# EAGLE design cartucho_throwhole (EAGLE 6.5.0)
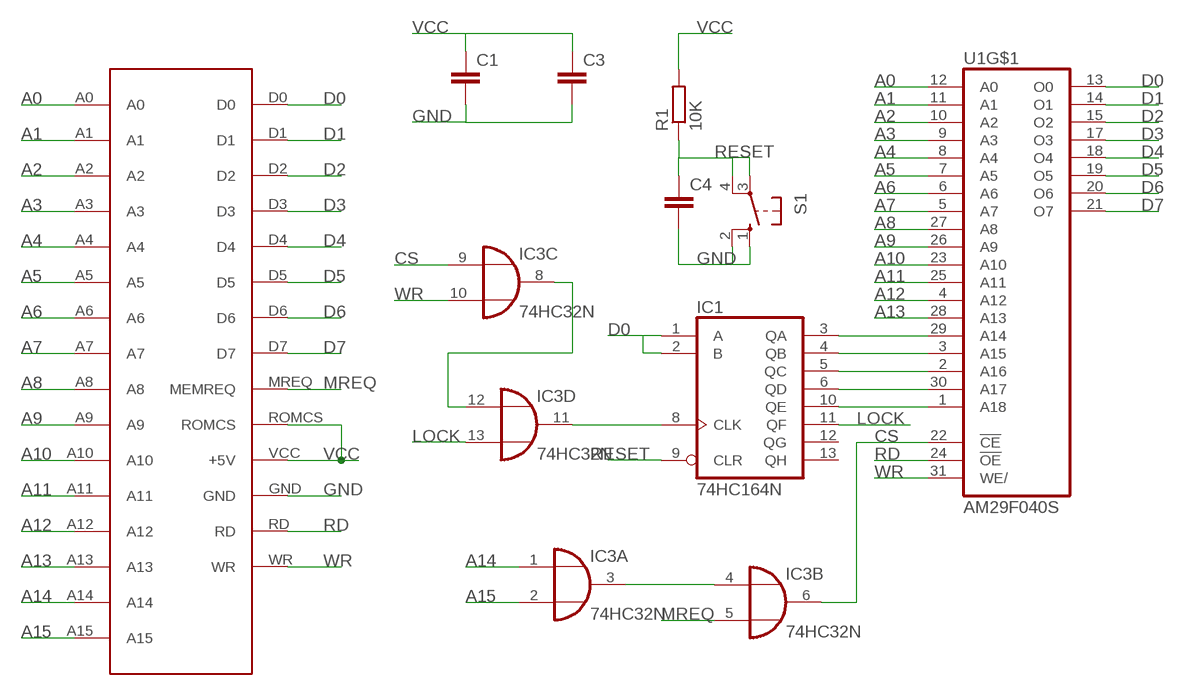
[diagram p0: schematic, sheet 1]

## Parts
C1  C-EU050-025X075  [C050-025X075]
C3  C-EU050-025X075  [C050-025X075]
C4  C-EU050-025X075  [C050-025X075]
IC1  74HC164N  [DIL14]
IC3  74HC32N  [DIL14]
R1  10K  R-EU_0204/7  [0204/7]
S1  10-XX  [B3F-10XX]
U1  AM29F040S  [PLCC-SR32]
U$1  IF2BUS  [BUS_CARTUCHO_IF2]

## Nets
A0: U1.12(A0) U$1.A0
A1: U1.11(A1) U$1.A1
A2: U1.10(A2) U$1.A2
A3: U1.9(A3) U$1.A3
A4: U1.8(A4) U$1.A4
A5: U1.7(A5) U$1.A5
A6: U1.6(A6) U$1.A6
A7: U1.5(A7) U$1.A7
A8: U1.27(A8) U$1.A8
A9: U1.26(A9) U$1.A9
A10: U1.23(A10) U$1.A10
A11: U1.25(A11) U$1.A11
A12: U1.4(A12) U$1.A12
A13: U1.28(A13) U$1.A13
A14: IC3.1(A:I0) U$1.A14
A15: IC3.2(A:I1) U$1.A15
CS: IC3.6(B:O) IC3.9(C:I0) U1.22(!CE)
D0: IC1.1(A) IC1.2(B) U1.13(O0) U$1.D0
D1: U1.14(O1) U$1.D1
D2: U1.15(O2) U$1.D2
D3: U1.17(O3) U$1.D3
D4: U1.18(O4) U$1.D4
D5: U1.19(O5) U$1.D5
D6: U1.20(O6) U$1.D6
D7: U1.21(O7) U$1.D7
GND: C1.2 C3.2 C4.2 S1.1(S) S1.2(S1) U$1.GND
LOCK: IC1.11(QF) IC3.13(D:I1)
MREQ: IC3.5(B:I1) U$1.MREQ(MEMREQ)
N$2: IC1.10(QE) U1.1(A18)
N$3: IC1.6(QD) U1.30(A17)
N$4: IC1.5(QC) U1.2(A16)
N$5: IC1.4(QB) U1.3(A15)
N$6: IC1.3(QA) U1.29(A14)
N$7: IC3.3(A:O) IC3.4(B:I0)
N$10: IC1.8(CLK) IC3.11(D:O)
N$11: IC3.8(C:O) IC3.12(D:I0)
RD: U1.24(!OE) U$1.RD
RESET: C4.1 IC1.9(CLR) R1.1 S1.3(P) S1.4(P1)
VCC: C1.1 C3.1 R1.2 U$1.ROMCS U$1.VCC(+5V)
WR: IC3.10(C:I1) U1.31(WE/) U$1.WR
Unconnected: IC1.12(QG) IC1.13(QH)

## Power pins joined to a net without a drawn wire
GND: IC1.7(GND) IC3.7(P:GND) U1.16(GND)
VCC: IC1.14(VCC) IC3.14(P:VCC) U1.32(VCC)

## Library data of the parts
C1 C3 C4 = rcl:C-EU: CAPACITOR, European symbol
IC1 = 74xx-us:74*164: 8-bit parallel out SHIFT REGISTER
IC3 = 74xx-eu:74*32: Quad 2-input OR gate
R1 = rcl:R-EU_: RESISTOR, European symbol
S1 = switch-omron:10-XX: OMRON SWITCH; MPN: B3F-1000; OC_FARNELL: 176432; OC_NEWARK: 36M3542
U1 = am29-memory:AM29F040S
U$1 = SPECTRUM:IF2BUS

## Board
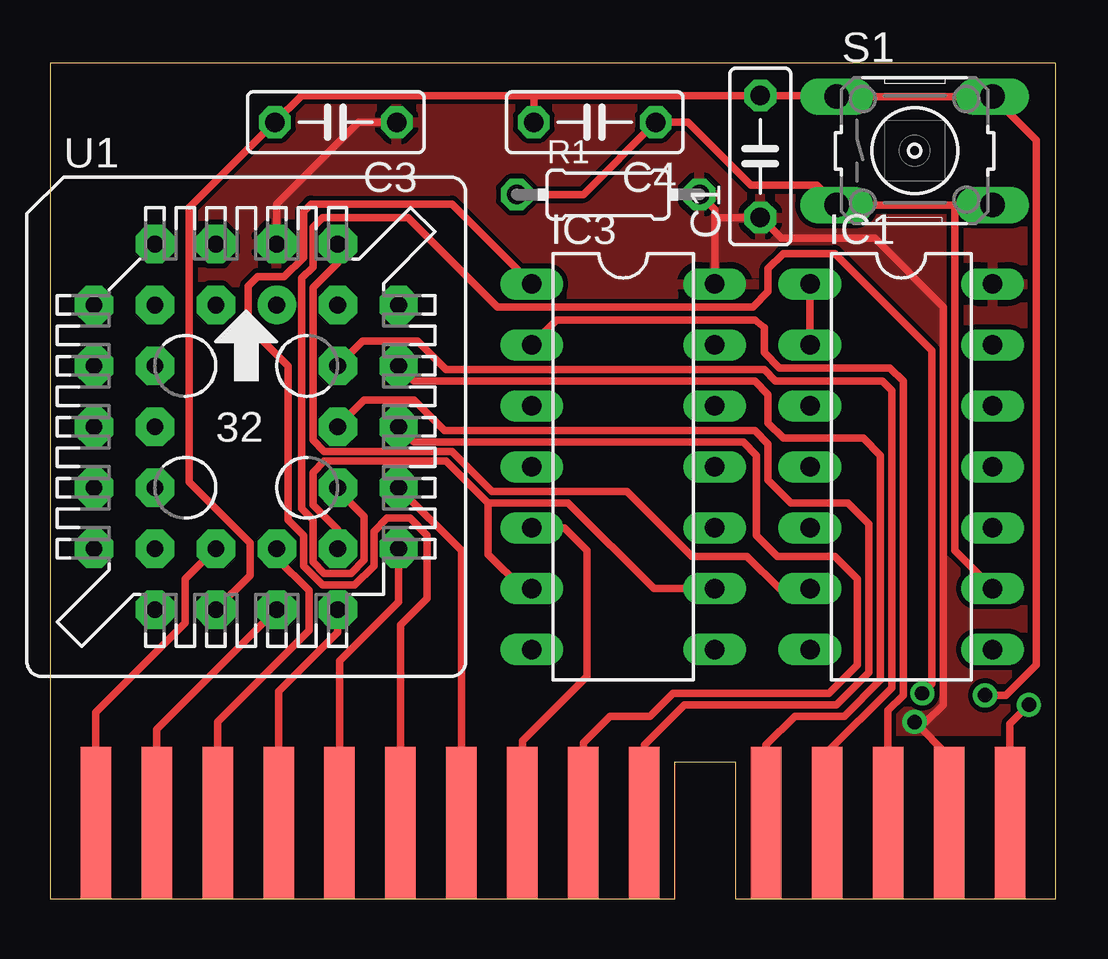
[diagram p1: board, top side]
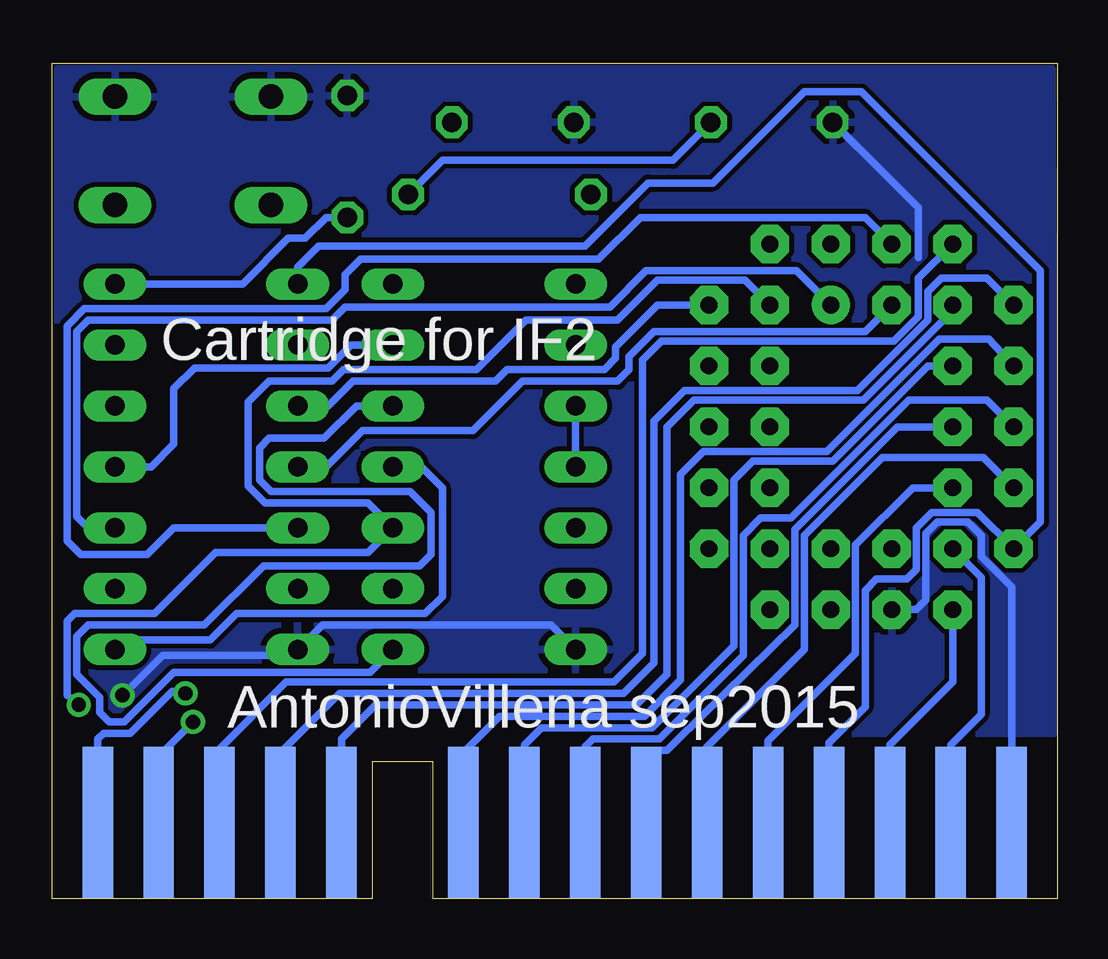
[diagram p2: board, bottom side, seen from below]

No outline drawn. Coordinates in mm, seen from the top.
Copper layers (1*16): Top 0.035mm / dielectric 1.5mm / Bottom 0.035mm
Design rules "default": minimum track width 10mil, minimum drill 24mil, track to track 8mil, track to pad 8mil, pad to pad 8mil, via to via 8mil, smd to smd 8mil, copper to edge 40mil, drill to drill 8mil, minimum pad ring 10mil, minimum via ring 8mil, stop-mask expansion 4mil, vias tented up to drill 0mil, thermal gap 10mil
Milling: 8 lines

### Footprints (pad centres in the part's own frame; a part is rotated, then mirrored left to right if it is on the bottom)
C050-025X075 = drill 0.813 octagon: 1 -2.54,0; 2 2.54,0
DIL14 = drill 0.813 long: 1 -7.62,-3.81; 2 -5.08,-3.81; 3 -2.54,-3.81; 4 0,-3.81; 5 2.54,-3.81; 6 5.08,-3.81; 7 7.62,-3.81; 8 7.62,3.81; 9 5.08,3.81; 10 2.54,3.81; 11 0,3.81; 12 -2.54,3.81; 13 -5.08,3.81; 14 -7.62,3.81
0204/7 = drill 0.813 octagon: 1 -3.81,0; 2 3.81,0
B3F-10XX = drill 1.016 long: 1 -3.251,2.261; 2 3.251,2.261; 3 -3.251,-2.261; 4 3.251,-2.261
PLCC-SR32 = drill 0.7 pad 1.6: 1 1.27,5.08 | drill 0.7 pad 1.6 octagon: 2 -1.27,7.62; 3 -1.27,5.08; 4 -3.81,7.62; 5 -6.35,5.08; 6 -3.81,5.08; 7 -6.35,2.54; 8 -3.81,2.54; 9 -6.35,0; 10 -3.81,0; 11 -6.35,-2.54; 12 -3.81,-2.54; 13 -6.35,-5.08; 14 -3.81,-7.62; 15 -3.81,-5.08; 16 -1.27,-7.62; 17 -1.27,-5.08; 18 1.27,-7.62; 19 1.27,-5.08; 20 3.81,-7.62; 21 6.35,-5.08; 22 3.81,-5.08; 23 6.35,-2.54; 24 3.81,-2.54; 25 6.35,0; 26 3.81,0; 27 6.35,2.54; 28 3.81,2.54; 29 6.35,5.08; 30 3.81,7.62; 31 3.81,5.08; 32 1.27,7.62
BUS_CARTUCHO_IF2 = smd 1.27 x 6.35 bottom: A0 -27.305,3.175; A1 -24.765,3.175; A2 -22.225,3.175; A3 -19.685,3.175; A4 -17.145,3.175; A5 -14.605,3.175; A6 -9.525,3.175; A7 -6.985,3.175; A12 -4.445,3.175; D0 -29.845,3.175; D1 -32.385,3.175; D2 -34.925,3.175; GND -37.465,3.175; RD 0.635,3.175; ROMCS -1.905,3.175 | smd 1.27 x 6.35: A8 -9.525,3.175; A9 -14.605,3.175; A10 -22.225,3.175; A11 -17.145,3.175; A13 -6.985,3.175; A14 -24.765,3.175; A15 -4.445,3.175; D3 -37.465,3.175; D4 -34.925,3.175; D5 -32.385,3.175; D6 -29.845,3.175; D7 -27.305,3.175; MREQ -19.685,3.175; VCC -1.905,3.175; WR 0.635,3.175

### Placement (x,y rotation side)
C1  100nF  [C050-025X075]  29.61,30.96 90 top
C3  100nF  [C050-025X075]  11.91,32.38 180 top
C4  4.7uF  [C050-025X075]  22.7,32.38 180 top
IC1  35.48,18.02 270 top
IC3  23.89,18.02 270 top
R1  23.26,29.37 0 top
S1  RESET  [B3F-10XX]  36.04,31.19 0 top
U1  8.18,19.68 0 top
U$1  39.37,0 0 top

### Tracks (layer width: path | path; a pad name or v marks a point on that pad's centre or on a via)
A0
  Bottom 0.305: U$1.A0 12.06,6.59 8.41,10.24 8.41,14.76 6.03,17.14 U1.12
A1
  Bottom 0.305: U$1.A1 14.61,6.35 10.56,10.4 10.56,15.16 7.3,18.41 3.1,18.41 U1.11
A2
  Bottom 0.305: U1.10 6.67,19.68 10.95,15.4 10.95,11.43 15.88,6.59 16.27,6.19 17.14,6.19 U$1.A2
A3
  Bottom 0.305: U$1.A3 19.68,6.35 19.37,6.67 16.59,6.67 13.1,10.16 13.1,15.16 12.38,15.88 11.11,15.88 6.19,20.8 2.94,20.8 U1.9
A4
  Bottom 0.305: U$1.A4 22.23,6.43 21.51,7.14 16.91,7.14 13.49,10.56 13.49,17.46 12.7,18.26 9.37,18.26 5.4,22.23 U1.8
A5
  Bottom 0.305: U1.7 2.86,23.34 4.92,23.34 9.6,18.65 14.76,18.65 15.72,17.7 15.72,9.13 17.22,7.62 23.26,7.62 24.77,6.11 U$1.A5
A6
  Bottom 0.305: U$1.A6 29.84,6.67 28.42,8.1 17.54,8.1 16.27,9.37 16.27,19.68 15.16,20.8 8.1,20.8 4.37,24.53 U1.6
A7
  Bottom 0.305: U$1.A7 32.38,6.11 29.92,8.57 18.1,8.57 16.83,9.84 16.83,19.92 15.56,21.19 8.33,21.19 5.4,24.13 5.4,25.32 4.84,25.88 2.94,25.88 U1.5
A8
  Top 0.305: U$1.A8 29.84,6.43 31.04,7.62 33.1,7.62 34.61,9.13 34.61,18.49 33.89,19.21 30.56,19.21 29.92,19.84 29.92,21.03 29.37,21.59 15.16,21.59 U1.27
A9
  Top 0.305: U$1.A9 24.77,6.43 26.43,8.1 32.78,8.1 34.13,9.45 34.13,15.64 33.26,16.51 30.88,16.51 29.92,17.46 29.92,18.97 29.37,19.53 16.43,19.53 15.16,20.8 13.1,20.8 U1.26
A10
  Top 0.305: U$1.A10 17.14,14.53 U1.23
A11
  Top 0.305: U$1.A11 22.23,6.51 23.34,7.62 25,7.62 25.96,8.57 32.46,8.57 33.66,9.76 33.66,13.34 32.7,14.29 30.32,14.29 29.45,15.16 29.45,18.49 28.89,19.05 15.16,19.05 U1.25
A12
  Bottom 0.305: U1.4 5.79,25.88 5.79,24.29 6.83,23.26 16.51,23.26 17.3,22.46 17.3,10.24 18.49,9.05 32.15,9.05 34.92,6.27 U$1.A12
A13
  Top 0.305: U$1.A13 32.38,6.11 35.08,8.81 35.08,21.19 34.69,21.59 30.24,21.59 29.77,22.07 16.51,22.07 15.32,23.26 13.02,23.26 U1.28
A14
  Top 0.305: U$1.A14 14.61,11.43 15.72,12.54 15.72,15.16 15,15.88 14.05,15.88 13.49,15.32 13.49,13.89 12.7,13.1 11.35,13.1 10.56,13.89 10.56,15.16 9.92,15.8 9.92,22.23 8.26,23.89 8.26,25.56 8.65,25.96 9.76,25.96 10.56,26.75 10.56,28.65 10.87,28.97 16.75,28.97 IC3.1
A15
  Top 0.305: U$1.A15 34.92,7.86 35.56,8.49 35.56,21.59 35,22.15 30.4,22.15 29.77,22.78 29.77,23.81 29.37,24.13 21.11,24.13 IC3.2
CS
  Top 0.305: 18.26,16.51 16.51,18.26 11.43,18.26 10.95,17.78 10.95,16.43 11.99,15.4 U1.22 | 18.26,16.51 21.59,16.51 25.16,12.94 IC3.9 | IC3.6 19.68,12.94 18.26,14.37 18.26,16.51
D0
  Top 0.305: IC1.1 IC1.2
  Bottom 0.305: U$1.D0 9.53,6.51 8.02,8.02 8.02,12.86 7.54,13.34 6.27,13.34 5.87,13.73 5.87,15.48 5.24,16.11 3.33,16.11 U1.13 0.71,15.72 0.71,26.19 8.18,33.66 10.56,33.66 14.37,29.84 17.07,29.84 19.68,27.23 30.8,27.23 31.67,26.35 IC1.1
D1
  Bottom 0.305: U1.14 4.37,9.05 6.99,6.43 U$1.D1
D2
  Bottom 0.305: U1.15 3.17,13.41 3.17,7.7 4.45,6.43 U$1.D2
D3
  Top 0.305: U$1.D3 1.91,7.78 5.64,11.51 5.64,13.34 U1.17
D4
  Top 0.305: U$1.D4 4.45,7.06 U1.18
D5
  Top 0.305: U1.19 9.45,14.21 10.79,12.86 10.79,11.19 6.99,7.38 U$1.D5
D6
  Top 0.305: U$1.D6 9.53,8.65 11.99,11.11 U1.20
D7
  Top 0.305: U$1.D7 12.06,9.92 14.53,12.38 U1.21
GND  (via drill 0.6)
  Top 0.305: U1.16 8.33,13.49 8.33,14.84 5.79,17.38 5.79,28.81 C3.2 10.48,33.5 20.16,33.5 | 20.16,33.5 C1.2 33.3,33.5 S1.1 S1.2 41.12,31.63 41.12,9.76 39.85,8.49 v38.97,8.49 | C4.2 20.16,33.5
  Bottom 0.305: U$1.GND 1.91,13.02 3.17,14.29 3.17,15.16 3.73,15.72 5,15.72 5.48,15.24 5.48,12.46 5.87,12.06 U1.16 | 8.33,31.35 C3.2 5.79,28.81 5.79,26.75 | IC3.7 21.11,11.43 30.64,11.43 IC1.7 32.31,10.4 32.54,10.16 37.31,10.16 v38.97,8.49
  pour Bottom: 0.24,34.61 41.67,34.61 41.67,6.91 0.16,6.91 0.16,23.65
LOCK
  Bottom 0.305: IC3.13 29.45,23.1 30.4,22.15 35.96,22.15 36.83,21.27 36.83,18.97 37.78,18.02 IC1.11
MREQ
  Top 0.305: U$1.MREQ 19.68,6.59 22.38,9.29 22.38,14.53 21.43,15.48 IC3.5
N$2
  Bottom 0.305: U1.1 10.87,26.19 17.14,26.19 18.65,24.69 29.69,24.69 30.24,24.13 40.4,24.13 40.88,23.65 40.88,15.95 40.4,15.48 IC1.10
N$3
  Top 0.305: IC1.6 30.4,12.94 29.05,14.29 26.75,14.29 24.05,16.99 18.41,16.99 16.75,18.65 11.43,18.65 10.95,19.13 10.95,25.48 11.99,26.51 U1.30
N$4
  Bottom 0.305: U1.2 8.02,28.42 17.38,28.42 19.13,26.67 29.05,26.67 29.69,26.04 29.69,25.4 30.48,24.61 40.56,24.61 41.27,23.89 41.27,14.92 40.72,14.37 37.94,14.37 36.83,15.48 IC1.5
N$5
  Bottom 0.305: U1.3 8.02,23.65 16.83,23.65 17.86,22.62 17.86,22.07 18.34,21.59 22.3,21.59 24.37,19.53 28.97,19.53 30.48,18.02 IC1.4
N$6
  Bottom 0.305: U1.29 16.67,24.77 18.41,23.02 18.41,22.54 18.89,22.07 22.94,22.07 23.42,21.59 29.37,21.59 30.4,20.56 IC1.3
N$7
  Bottom 0.305: IC3.4 IC3.3
N$10
  Bottom 0.305: IC3.11 26.51,18.02 25.64,17.14 25.64,12.62 26.35,11.91 34.21,11.91 35.32,10.79 38.89,10.79 IC1.8
N$11
  Bottom 0.305: IC3.12 29.21,20.56 30.56,19.21 32.86,19.21 33.26,18.81 33.26,17.46 32.78,16.99 26.99,16.99 26.11,16.11 26.11,14.37 26.59,13.89 33.1,13.89 35.56,11.43 40.4,11.43 40.88,10.95 40.88,9.37 39.93,8.41 39.93,7.78 39.53,7.38 38.89,7.38 36.83,9.45 28.65,9.45 IC3.8
RD  (via drill 0.6)
  Top 0.305: U1.24 11.99,17.07 13.1,15.95 13.1,14.13 12.54,13.57 11.43,13.57 10.95,14.05 10.95,15.8 10.48,16.27 10.48,25.88 10.95,26.35 10.95,28.02 11.35,28.42 14.92,28.42 18.65,24.69 29.29,24.69 29.92,25.32 29.92,26.27 30.56,26.91 32.7,26.91 36.75,22.86 36.75,8.97 v36.35,8.57
  Bottom 0.305: U$1.RD 40.01,6.67 39.77,6.91 38.66,6.91 36.91,8.65 36.35,8.65 v36.35,8.57
RESET
  Top 0.305: R1.1 22.23,29.37 C4.1 26.59,32.38 29.21,29.77 31.95,29.77 S1.3 37.62,28.93 | 39.96,28.93 S1.4 37.62,28.93 | IC1.9 37.7,14.53 37.7,28.85 37.62,28.93
VCC  (via drill 0.6)
  Top 0.305: IC3.14 27.7,28.26 | 27.7,28.26 27.7,28.73 R1.2 | C3.1 12.86,32.38 9.45,28.97 U1.32 | 27.7,28.26 27.86,28.42 C1.1 30.48,27.54 34.37,27.54 37.23,24.69 37.23,8.1 36.51,7.38 v36.04,7.38 37.47,5.95 U$1.ROMCS
  Bottom 0.305: C3.1 16.03,30.8 25.64,30.8 R1.2 | U$1.ROMCS 37.47,5.95 v36.04,7.38 | IC1.14 33.97,25.64 32.07,27.54 31.35,27.54 30.48,28.42 C1.1
  pour Top: 0.24,34.61 41.67,34.61 41.67,6.99 0.24,6.91
WR  (via drill 0.6)
  Top 0.305: U$1.WR 40.01,7.3 v40.8,8.1
  Bottom 0.305: U1.31 13.02,25.8 16.67,25.8 18.34,24.13 22.15,24.13 24.21,22.07 29.77,22.07 30.24,21.59 32.86,21.59 33.73,20.72 33.73,17.22 33.02,16.51 28.73,16.51 IC3.10 28.73,14.45 35.08,14.45 37.62,11.91 40.96,11.91 41.27,11.59 41.27,8.49 v40.8,8.1

### Text on the board
bPlace: Cartridge for IF2 | AntonioVillena sep2015